# EAGLE design 13A-777 (EAGLE 9.6.2)
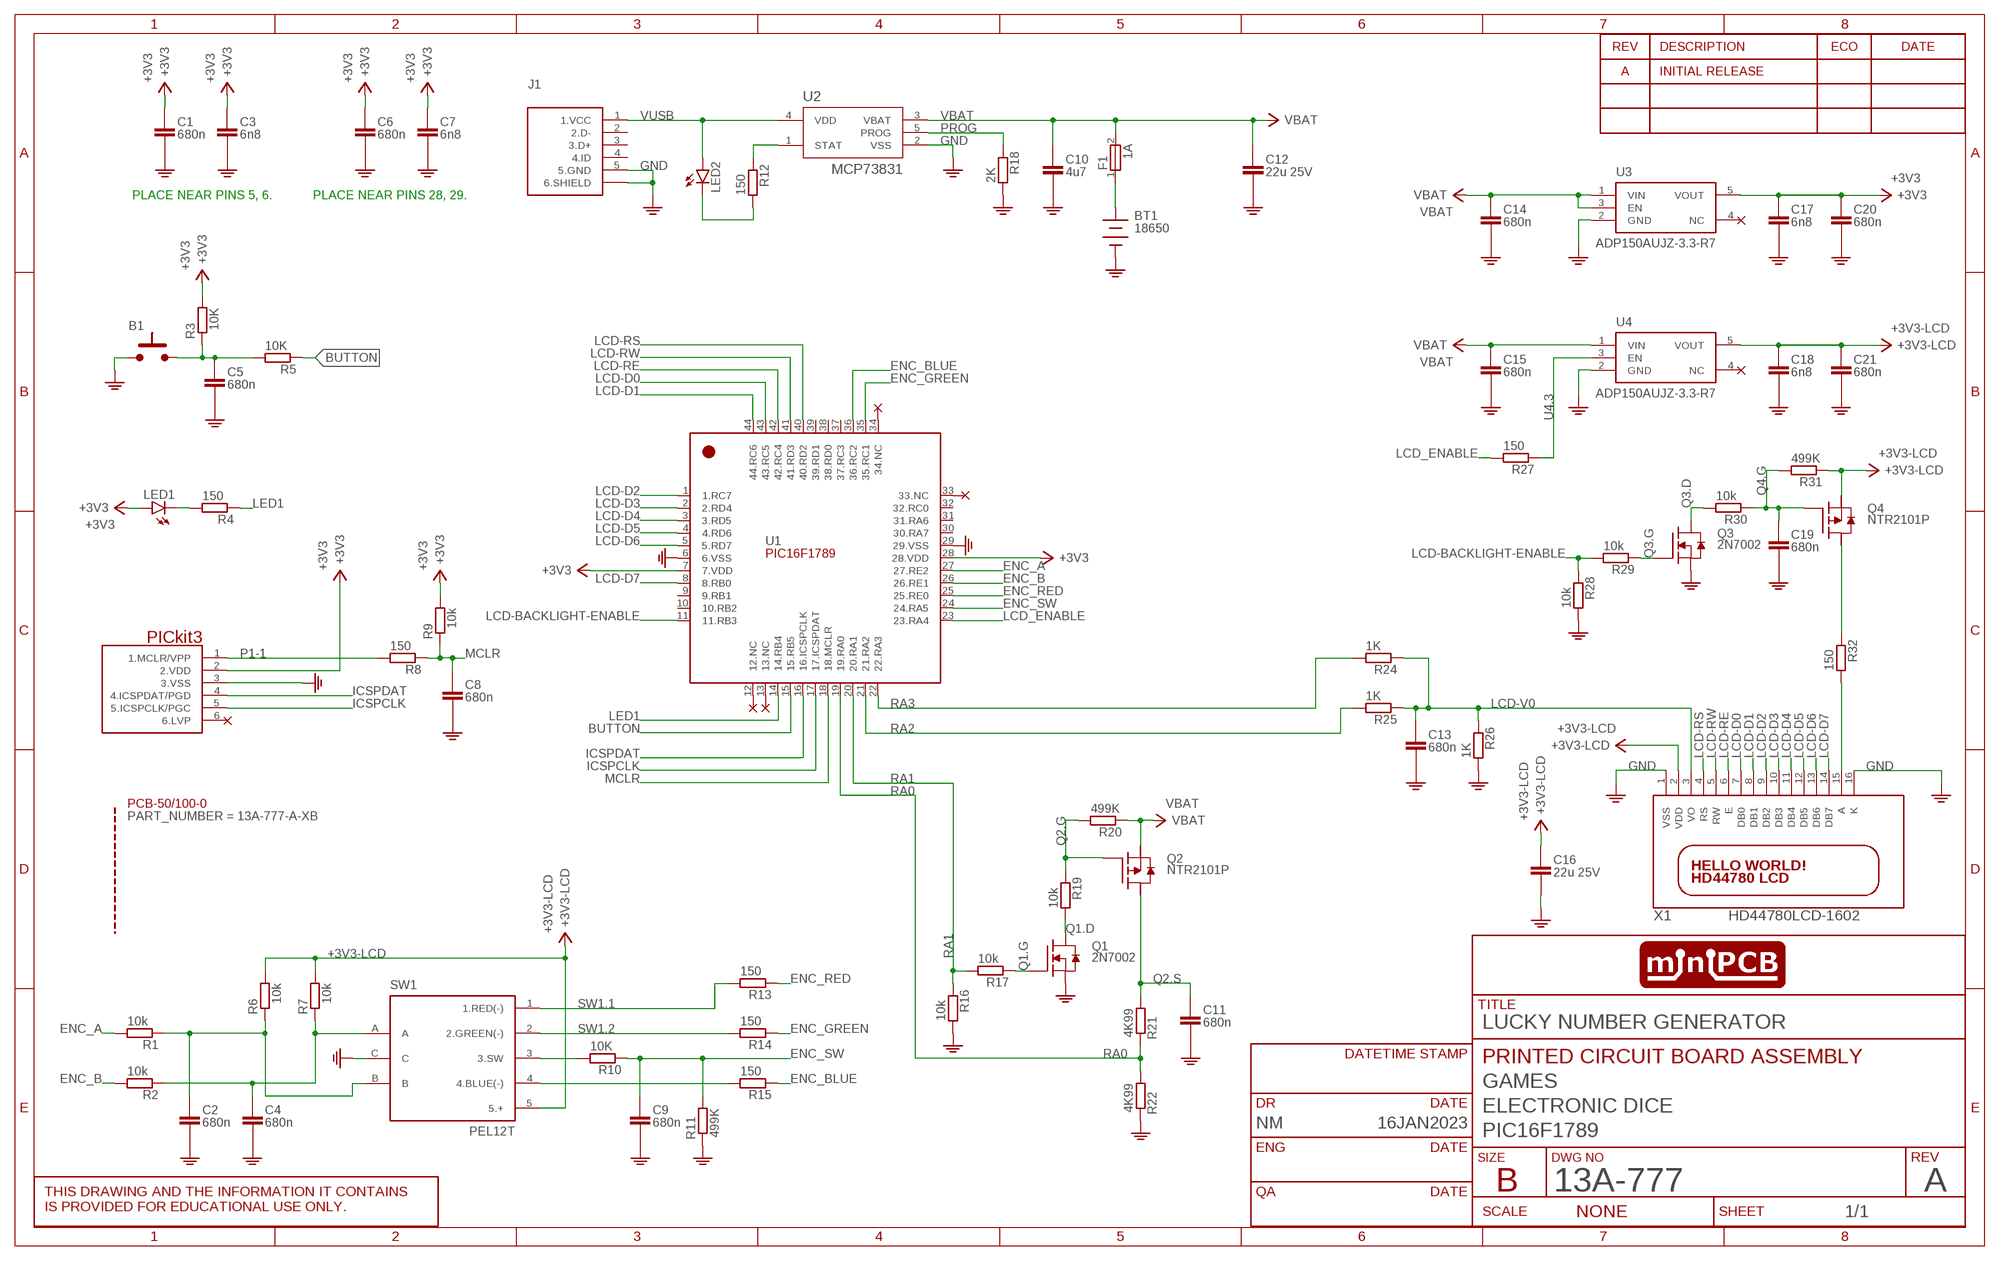
[diagram p0: schematic, sheet 1]
SHEET1 (SCHEMATIC): CIRCUIT_CATEGORY: GAMES; CIRCUIT_NAME: ELECTRONIC DICE; CIRCUIT_VARIANT: PIC16F1789; DR: NM; DR_DATE: 16JAN2023; PCB_PCBA: PRINTED CIRCUIT BOARD ASSEMBLY; REVA: A; REVISION: A; TITLE: LUCKY NUMBER GENERATOR

## Parts
B1  PUSHBUTTON6X6MM  [6X6MM]
BT1  18650  BATTERY18650-NOHOLES  [BATTERY-18650-1-NOHOLES]
C1  680n  CAPACITOR1206  [C1206]
C2  680n  CAPACITOR1206  [C1206]
C3  6n8  CAPACITOR1206  [C1206]
C4  680n  CAPACITOR1206  [C1206]
C5  680n  CAPACITOR1206  [C1206]
C6  680n  CAPACITOR1206  [C1206]
C7  6n8  CAPACITOR1206  [C1206]
C8  680n  CAPACITOR1206  [C1206]
C9  680n  CAPACITOR1206  [C1206]
C10  4u7  CAPACITOR1206  [C1206]
C11  680n  CAPACITOR1206  [C1206]
C12  22u 25V  CAPACITOR3.5MM  [C3-5MM]
C13  680n  CAPACITOR1206  [C1206]
C14  680n  CAPACITOR1206  [C1206]
C15  680n  CAPACITOR1206  [C1206]
C16  22u 25V  CAPACITOR3.5MM  [C3-5MM]
C17  6n8  CAPACITOR1206  [C1206]
C18  6n8  CAPACITOR1206  [C1206]
C19  680n  CAPACITOR1206  [C1206]
C20  680n  CAPACITOR1206  [C1206]
C21  680n  CAPACITOR1206  [C1206]
F1  1A  FUSE-1812-1A  [1812L010DR]
J1  USB2LUG  [USB_MICRO_B]
LED1  LEDCHIP-LED0805  [CHIP-LED0805]
LED2  LEDCHIP-LED0805  [CHIP-LED0805]
PCB  PCB-50/100-0  MINIPCB_0P50X100MM  [MINIPCB_0P_50X100MM]
Q1  2N7002  MOSFET-NSOT23  [SOT23]
Q2  NTR2101P  MOSFET-PNTR2101PT1G  [SOT23]
Q3  2N7002  MOSFET-NSOT23  [SOT23]
Q4  NTR2101P  MOSFET-PNTR2101PT1G  [SOT23]
R1  10k  RESISTORSMD  [R0805]
R2  10k  RESISTORSMD  [R0805]
R3  10K  RESISTORSMD  [R0805]
R4  150  RESISTORSMD  [R0805]
R5  10K  RESISTORSMD  [R0805]
R6  10k  RESISTORSMD  [R0805]
R7  10k  RESISTORSMD  [R0805]
R8  150  RESISTORSMD  [R0805]
R9  10k  RESISTORSMD  [R0805]
R10  10K  RESISTORSMD  [R0805]
R11  499K  RESISTORSMD  [R0805]
R12  150  RESISTORSMD  [R0805]
R13  150  RESISTORSMD  [R0805]
R14  150  RESISTORSMD  [R0805]
R15  150  RESISTORSMD  [R0805]
R16  10k  RESISTORSMD  [R0805]
R17  10k  RESISTORSMD  [R0805]
R18  2K  RESISTORSMD  [R0805]
R19  10k  RESISTORSMD  [R0805]
R20  499K  RESISTORSMD  [R0805]
R21  4K99  RESISTORSMD  [R0805]
R22  4K99  RESISTORSMD  [R0805]
R24  1K  RESISTORSMD  [R0805]
R25  1K  RESISTORSMD  [R0805]
R26  1K  RESISTORSMD  [R0805]
R27  150  RESISTORSMD  [R0805]
R28  10k  RESISTORSMD  [R0805]
R29  10k  RESISTORSMD  [R0805]
R30  10k  RESISTORSMD  [R0805]
R31  499K  RESISTORSMD  [R0805]
R32  150  RESISTORSMD  [R0805]
SW1  PEL12T  SWITCH-ROTARY_ENCODER+SW+3LEDSPEL12T  [SWITCH-ROTARY_ENCODER-12MM]
U1  PIC16F1789T-I/PT  PIC16F1789  [SQFP-S-10X10-44]
U2  MCP73831  MCP73831T-2ATI/OTSOT-23-5_MC_MCH  [SOT-23-5_MC_MCH]
U3  ADP150AUJZ-3.3-R7  ADP150  [SOT25]
U4  ADP150AUJZ-3.3-R7  ADP150  [SOT25]
U$1  PICKIT3ARROW  [PINS_6_PICKIT3]
X1  HD44780LCD-1602  [LCD1602]

## Nets
+3V3: C1.+ C3.+ C6.+ C7.+ C17.+ C20.+ LED1.A R3.2 R9.2 U1.7(7.VDD) U1.28(28.VDD) U3.5(VOUT) U$1.2(2.VDD)
+3V3-LCD: C16.+ C18.+ C21.+ Q4.3(S) R6.2 R7.2 R31.1 SW1.5(5.+) U4.5(VOUT) X1.2(VDD)
B1: B1.3.B B1.4.B C5.+ R3.1 R5.2
BT+: BT1.+ F1.1
BUTTON: R5.1 U1.15(15.RB5)
ENC_A: R1.2 U1.27(27.RE2)
ENC_B: R2.2 U1.26(26.RE1)
ENC_BLUE: R15.1 U1.36(36.RC2)
ENC_GREEN: R14.1 U1.35(35.RC1)
ENC_RED: R13.1 U1.25(25.RE0)
ENC_SW: C9.+ R10.1 R11.2 U1.24(24.RA5)
GND: B1.1.A B1.2.A BT1.1(-) C1.- C2.- C3.- C4.- C5.- C6.- C7.- C8.- C9.- C10.- C11.- C12.- C13.- C14.- C15.- C16.- C17.- C18.- C19.- C20.- C21.- J1.5(5.GND) J1.GND5(6.SHIELD) J1.GND6(6.SHIELD) J1.GND7(6.SHIELD) J1.GND8(6.SHIELD) J1.GND9(6.SHIELD) J1.GND10(6.SHIELD) J1.XPAD3(6.SHIELD) J1.XPAD4(6.SHIELD) Q1.2(S) Q3.2(S) R11.1 R16.2 R18.2 R22.1 R26.2 R28.2 SW1.C U1.6(6.VSS) U1.29(29.VSS) U2.2(VSS) U3.2(GND) U4.2(GND) U$1.3(3.VSS) X1.1(VSS) X1.16(K)
ICSPCLK: U1.17(17.ICSPDAT) U$1.5(5.ICSPCLK/PGC)
ICSPDAT: U1.16(16.ICSPCLK) U$1.4(4.ICSPDAT/PGD)
LCD-BACKLIGHT-A: R32.2 X1.15(A)
LCD-BACKLIGHT-ENABLE: R28.1 R29.2 U1.11(11.RB3)
LCD-D0: U1.43(43.RC5) X1.7(DB0)
LCD-D1: U1.44(44.RC6) X1.8(DB1)
LCD-D2: U1.1(1.RC7) X1.9(DB2)
LCD-D3: U1.2(2.RD4) X1.10(DB3)
LCD-D4: U1.3(3.RD5) X1.11(DB4)
LCD-D5: U1.4(4.RD6) X1.12(DB5)
LCD-D6: U1.5(5.RD7) X1.13(DB6)
LCD-D7: U1.8(8.RB0) X1.14(DB7)
LCD-RE: U1.42(42.RC4) X1.6(E)
LCD-RS: U1.40(40.RD2) X1.4(RS)
LCD-RW: U1.41(41.RD3) X1.5(RW)
LCD-V0: C13.+ R24.1 R25.1 R26.1 X1.3(VO)
LCD_ENABLE: R27.2 U1.23(23.RA4)
LED1: R4.1 U1.14(14.RB4)
LED1.K: LED1.C R4.2
LED2.K: LED2.C R12.2
MCLR: C8.+ R8.1 R9.1 U1.18(18.MCLR)
P1-1: R8.2 U$1.1(1.MCLR/VPP)
PROG: R18.1 U2.5(PROG)
Q1.D: Q1.3(D) R19.2
Q1.G: Q1.1(G) R17.1
Q2.G: Q2.1(G) R19.1 R20.2
Q2.S: C11.+ Q2.2(D) R21.2
Q3.D: Q3.3(D) R30.2
Q3.G: Q3.1(G) R29.1
Q4.G: C19.+ Q4.1(G) R30.1 R31.2
Q4.S: Q4.2(D) R32.1
RA0: R21.1 R22.2 U1.19(19.RA0)
RA1: R16.1 R17.2 U1.20(20.RA1)
RA2: R25.2 U1.21(21.RA2)
RA3: R24.2 U1.22(22.RA3)
SW1.1: R13.2 SW1.1(1.RED(-))
SW1.2: R14.2 SW1.2(2.GREEN(-))
SW1.3: R10.2 SW1.3(3.SW)
SW1.4: R15.2 SW1.4(4.BLUE(-))
SW1.A: C2.+ R1.1 R6.1 SW1.B
SW1.B: C4.+ R2.1 R7.1 SW1.A
U4.1: R12.1 U2.1(STAT)
U4.3: R27.1 U4.3(EN)
VBAT: C10.+ C12.+ C14.+ C15.+ F1.2 Q2.3(S) R20.1 U2.3(VBAT) U3.1(VIN) U3.3(EN) U4.1(VIN)
VUSB: J1.1(1.VCC) LED2.A U2.4(VDD)
Unconnected: J1.2(2.D-) J1.3(3.D+) J1.4(4.ID) U1.9(9.RB1) U1.10(10.RB2) U1.12(12.NC) U1.13(13.NC) U1.30(30.RA7) U1.31(31.RA6) U1.32(32.RC0) U1.33(33.NC) U1.34(34.NC) U1.37(37.RC3) U1.38(38.RD0) U1.39(39.RD1) U3.4(NC) U4.4(NC) U$1.6(6.LVP)

## Notes on the sheet
- PLACE NEAR PINS 5, 6. | PLACE NEAR PINS 28, 29.

## Library data of the parts
B1 = minipcb:PUSHBUTTON: Tactile push button switch
BT1 = minipcb:BATTERY: 2xAAA battery holder for VIVA
C1-C21 = minipcb:CAPACITOR
F1 = minipcb:FUSE-1812-1A: Resettable Fuses - PPTC PTC 60V POLYFUSE SURF MOUNT 1812 0.5A Source: Datasheet <http://www.littelfuse.com/~/media/electronics/datasheets/resettable_ptcs/littelfuse_ptc_1812l_datasheet.pdf.pdf>; ARROW_PART_NUMBER: 1812L050/60MR; ARROW_PRICE-STOCK: https://www.arrow.com/en/products/1812l05060mr/littelfuse?region=nac; DESCRIPTION: Resettable Fuses - PPTC PTC 60V POLYFUSE SURF MOUNT 1812 0.5A; HEIGHT: 1.25mm; MANUFACTURER_NAME: LITTELFUSE; MANUFACTURER_PART_NUMBER: 1812L050/60MR; MOUSER_PART_NUMBER: 576-1812L050/60MR; MOUSER_PRICE-STOCK: https://www.mouser.co.uk/ProductDetail/Littelfuse/1812L050-60MR?qs=lM4gFlnEeEOTL6GzziLnSw%3D%3D
J1 = minipcb:USB
LED1 LED2 = minipcb:LED: LED OSRAM: - CHIPLED LG R971, LG N971, LY N971, LG Q971, LY Q971, LO R971, LY R971 LH N974, LH R974 LS Q976, LO Q976, LY Q976 LO Q996 - Hyper CHIPLED LW Q18S LB Q993, LB Q99A, LB R99A - SideLED LS A670, LO A670, LY A670, LG A670, LP A670 LB A673, LV A673, LT A673, LW A673 LH A674 LY A675 LS A676, LA A676, LO A676, LY A676, LW A676 LS A679, LY A679, LG A679 - Hyper Micro SIDELED® LS Y876, LA Y876, LO Y876, LY Y876 LT Y87S - SmartLED LW L88C, LW L88S LB L89C, LB L89S, LG L890 LS L89K, LO L89K, LY L89K LS L896, LA L896, LO L896, LY L896 - TOPLED LS T670, LO T670, LY T670, LG T670, LP T670 LSG T670, LSP T670, LSY T670, LOP T670, LYG T670 LG T671, LOG T671, LSG T671 LB T673, LV T673, LT T673, LW T673 LH T674 LS T676, LA T676, LO T676, LY T676, LB T676, LH T676, LSB T676, LW T676 LB T67C, LV T67C, LT T67C, LS T67K, LO T67K, LY T67K, LW E67C LS E67B, LA E67B, LO E67B, LY E67B, LB E67C, LV E67C, LT E67C LW T67C LS T679, LY T679, LG T679 LS T770, LO T770, LY T770, LG T770, LP T770 LB T773, LV T773, LT T773, LW T773 LH T774 LS E675, LA E675, LY E675, LS T675 LS T776, LA T776, LO T776, LY T776, LB T776 LHGB T686 LT T68C, LB T68C - Hyper Mini TOPLED® LB M676 - Mini TOPLED Santana® LG M470 LS M47K, LO M47K, LY M47K Source: http://www.osram.convergy.de LUXEON: - LUMILED® LXK2-PW12-R00, LXK2-PW12-S00, LXK2-PW14-U00, LXK2-PW14-V00 LXK2-PM12-R00, LXK2-PM12-S00, LXK2-PM14-U00 LXK2-PE12-Q00, LXK2-PE12-R00, LXK2-PE12-S00, LXK2-PE14-T00, LXK2-PE14-U00 LXK2-PB12-K00, LXK2-PB12-L00, LXK2-PB12-M00, LXK2-PB14-N00, LXK2-PB14-P00, LXK2-PB14-Q00 LXK2-PR12-L00, LXK2-PR12-M00, LXK2-PR14-Q00, LXK2-PR14-R00 LXK2-PD12-Q00, LXK2-PD12-R00, LXK2-PD12-S00 LXK2-PH12-R00, LXK2-PH12-S00 LXK2-PL12-P00, LXK2-PL12-Q00, LXK2-PL12-R00 Source: www.luxeon.com KINGBRIGHT: KA-3528ASYC Source: www.kingbright.com
PCB = minipcb:MINIPCB_0P; PART_NUMBER: 13A-777-A-XB; REVISION: A
Q1 Q3 = minipcb:MOSFET-N
Q2 Q4 = minipcb:MOSFET-P
R1-R22 R24-R32 = minipcb:RESISTOR
SW1 = minipcb:SWITCH-ROTARY_ENCODER+SW+3LEDS: PEL12T - 12 mm Encoder with Switch and Illuminated Shaft PEL12T-4xxxF-S1024
U1 = minipcb:PIC16F1789
U2 = minipcb:MCP73831T-2ATI/OT; COPYRIGHT: Copyright (C) 2023 Ultra Librarian. All rights reserved.; MANUFACTURER_PART_NUMBER: MCP73831T-2ATI/OT; MFR_NAME: Microchip
U3 U4 = minipcb:ADP150: Ultralow Noise, 150mA CMOS Linear Regulator
U$1 = minipcb:PICKIT3
X1 = minipcb:HD44780LCD: HD44780 LCD Standard character type LCDs, available in sizes from 8x1 to 40x4!

## Board
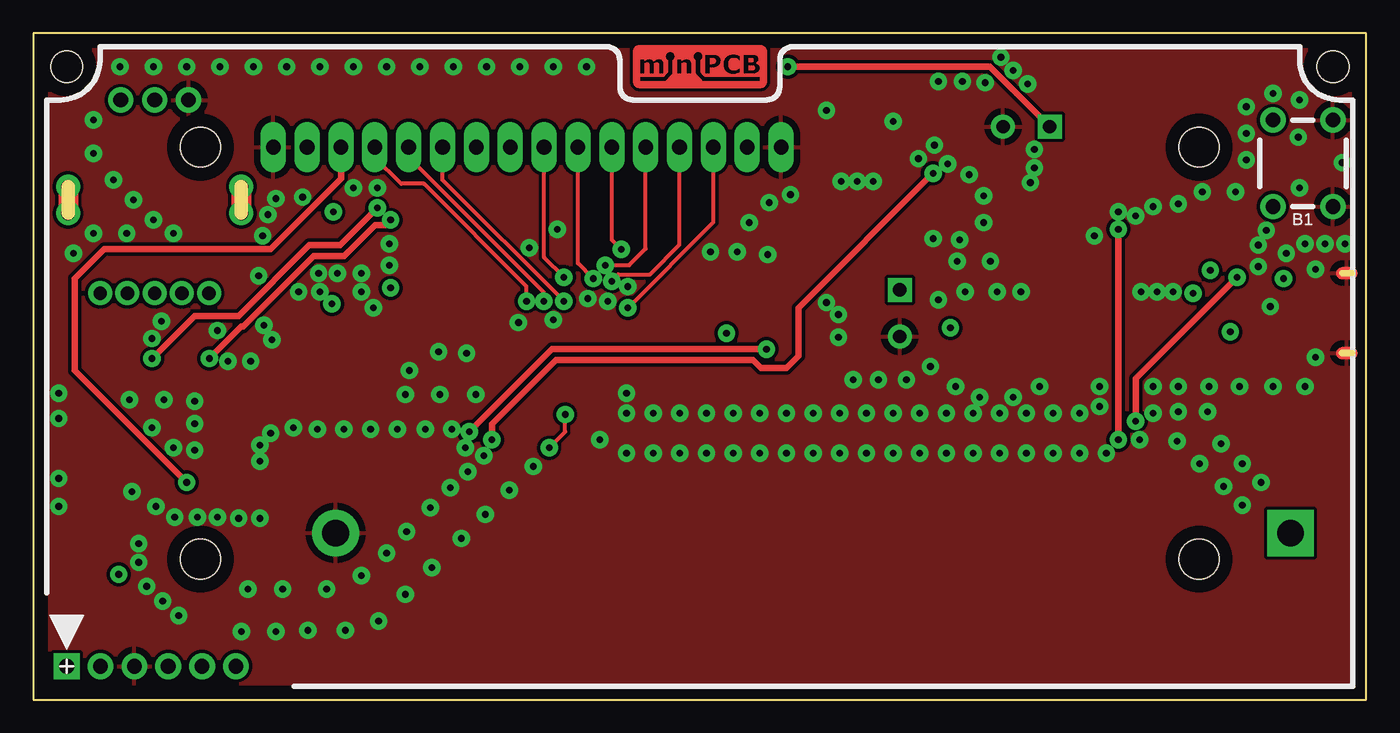
[diagram p1: board, top side]
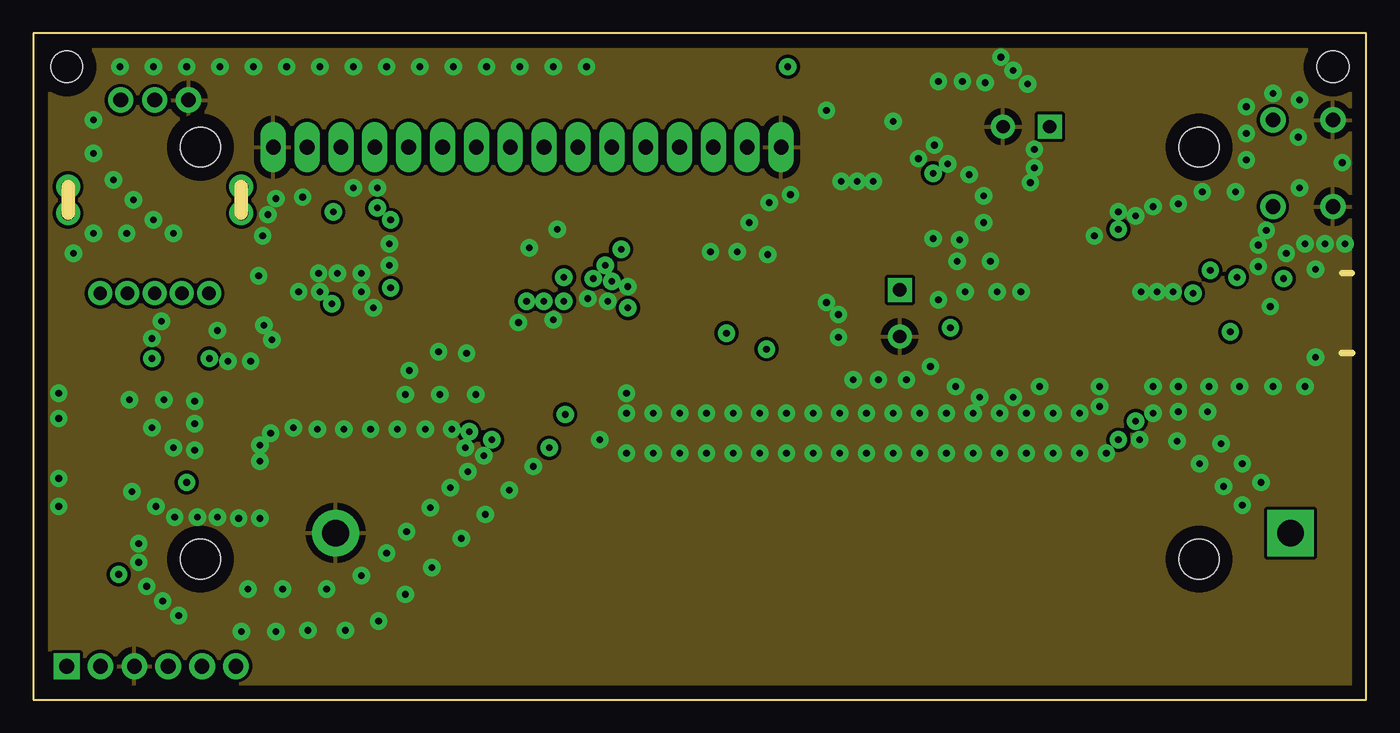
[diagram p2: board, inner layer Route2]
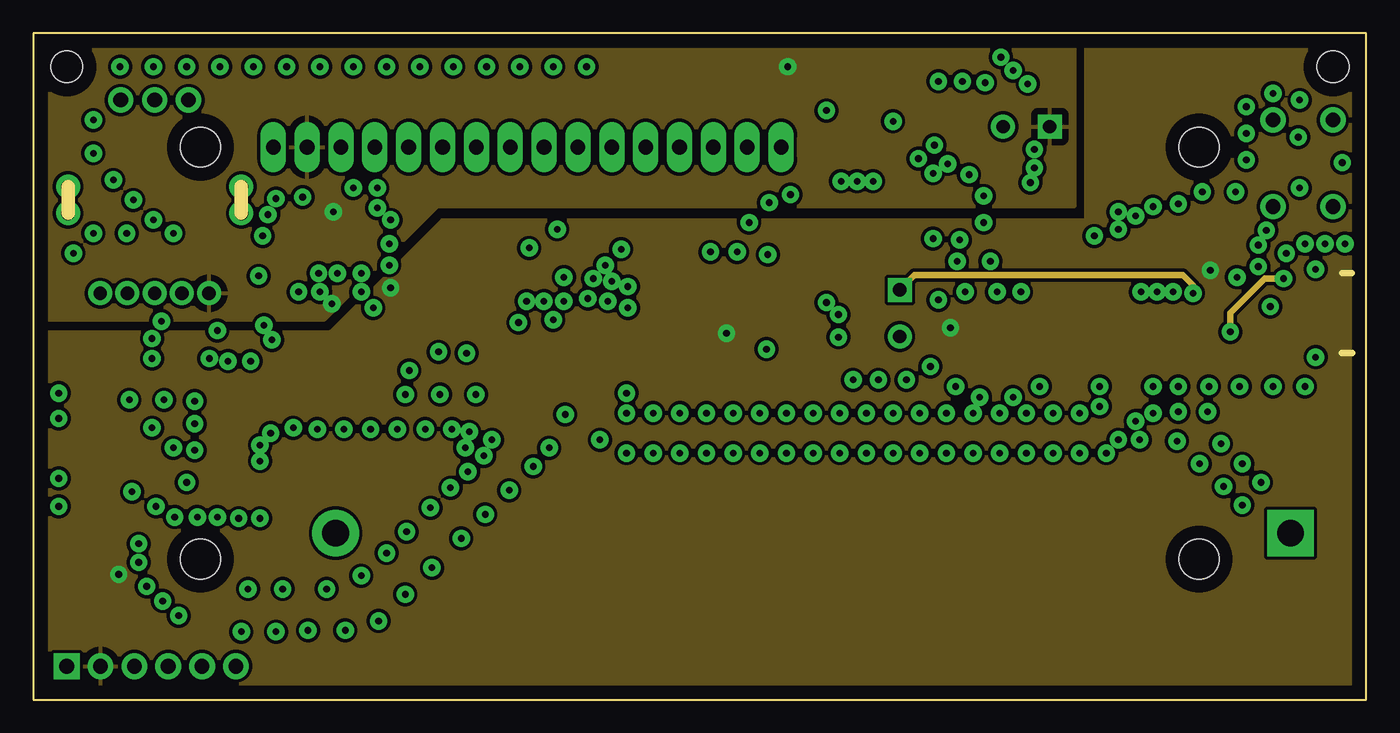
[diagram p3: board, inner layer Route15]
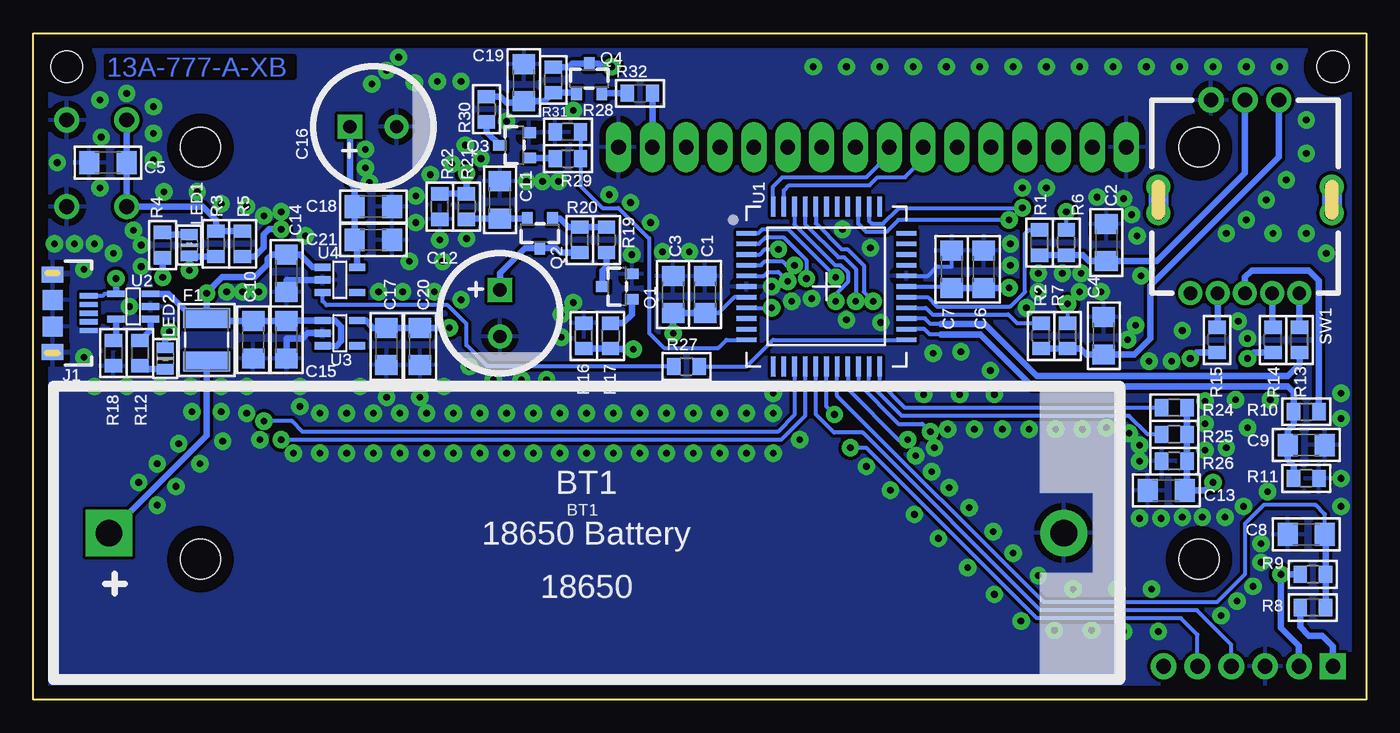
[diagram p4: board, bottom side, seen from below]

Size 100 x 50 mm. Coordinates in mm from the lower left corner, seen from the top.
Outline: 0,0 100,0 100,50 0,50 0,0
Copper layers (1*16): Top 0.035mm / dielectric 1.5mm / Bottom 0.035mm
Design rules "minipcb": minimum track width 0.2mm, minimum drill 0.5mm, track to track 0.25mm, track to pad 0.5mm, pad to pad 0.5mm, via to via 0.5mm, smd to smd 0.15mm, copper to edge 1mm, drill to drill 1mm, minimum pad ring 0.4mm, minimum via ring 0.4mm, stop-mask expansion 0.1mm, vias tented up to drill 0.6mm, thermal gap 0.5mm

### Footprints (pad centres in the part's own frame; a part is rotated, then mirrored left to right if it is on the bottom)
6X6MM = drill 1.1: 1.A 0,0; 2.A 6.5,0; 3.B 0,4.5; 4.B 6.5,4.5
BATTERY-18650-1-NOHOLES = drill 2 pad 3.5: 1 35.82,0 | drill 2 pad 3.5 square: + -35.82,0
C1206 = smd 1.5 x 1.7: + -1.4,0; - 1.4,0
C3-5MM = drill 1 square: + -1.75,0 | drill 1: - 1.75,0
1812L010DR = smd 1.5 x 3.5: 1 -1.615,0; 2 1.615,0
USB_MICRO_B = smd 0.4 x 1.35: 1 -1.3,1.35; 2 -0.65,1.35; 3 0,1.35; 4 0.65,1.35; 5 1.3,1.35 | smd 0.9 x 1.6: GND5 -3,-1.35; GND8 3,-1.35 | smd 0.9 x 1.6 bottom: GND6 -3,-1.35; GND9 3,-1.35 | smd 1.2 x 1.6: GND7 -2.9,-1.35; GND10 2.9,-1.35 | smd 1.5 x 1.5: XPAD3 -1,-1.35; XPAD4 1,-1.35
CHIP-LED0805 = smd 1.27 x 0.8: A 0,-0.8; C 0,0.8
MINIPCB_0P_50X100MM = hole 2.4: 97.5,47.5; 2.5,47.5
SOT23 = smd 0.8 x 1: 1 -0.95,-1.1; 2 0.95,-1.1; 3 0,1.1
R0805 = smd 1 x 1.3: 1 -0.95,0; 2 0.95,0
SWITCH-ROTARY_ENCODER-12MM = drill 1: 1 7,4.08; 2 7,2.04; 3 7,0; 4 7,-2.04; 5 7,-4.08; GND1 -1,6.5; GND2 1,6.5; GND3 -1,-6.5; GND4 1,-6.5 | drill 1.1: A -7.5,2.54; B -7.5,0; C -7.5,-2.54
SQFP-S-10X10-44 = smd 0.35 x 1.5: 1 -4,-6; 2 -3.2,-6; 3 -2.4,-6; 4 -1.6,-6; 5 -0.8,-6; 6 0,-6; 7 0.8,-6; 8 1.6,-6; 9 2.4,-6; 10 3.2,-6; 11 4,-6; 23 4,6; 24 3.2,6; 25 2.4,6; 26 1.6,6; 27 0.8,6; 28 0,6; 29 -0.8,6; 30 -1.6,6; 31 -2.4,6; 32 -3.2,6; 33 -4,6 | smd 1.5 x 0.35: 12 6,-4; 13 6,-3.2; 14 6,-2.4; 15 6,-1.6; 16 6,-0.8; 17 6,0; 18 6,0.8; 19 6,1.6; 20 6,2.4; 21 6,3.2; 22 6,4; 34 -6,4; 35 -6,3.2; 36 -6,2.4; 37 -6,1.6; 38 -6,0.8; 39 -6,0; 40 -6,-0.8; 41 -6,-1.6; 42 -6,-2.4; 43 -6,-3.2; 44 -6,-4
SOT-23-5_MC_MCH = smd 1.321 x 0.508: 1 -1.295,0.95; 2 -1.295,0; 3 -1.295,-0.95; 4 1.295,-0.95; 5 1.295,0.95
SOT25 = smd 0.55 x 1.2: 1 -0.95,-1.3; 2 0,-1.3; 3 0.95,-1.3; 4 0.95,1.3; 5 -0.95,1.3
PINS_6_PICKIT3 = drill 1.1 pad 1.93 square: 1 0,0 | drill 1.1 pad 1.93: 2 0,-2.54; 3 0,-5.08; 4 0,-7.62; 5 0,-10.16; 6 0,-12.7
LCD1602 = drill 1.1 long: 1 8,33.46; 2 10.54,33.46; 3 13.08,33.46; 4 15.62,33.46; 5 18.16,33.46; 6 20.7,33.46; 7 23.24,33.46; 8 25.78,33.46; 9 28.32,33.46; 10 30.86,33.46; 11 33.4,33.46; 12 35.94,33.46; 13 38.48,33.46; 14 41.02,33.46; 15 43.56,33.46; 16 46.1,33.46 | hole 3: 2.54,2.54; 2.54,33.46; 77.46,33.46; 77.46,2.54

### Placement (x,y rotation side)
B1  97.5,37 90 top
BT1  58.5,12.5 0 bottom
C1  49.6,30.4 90 bottom
C2  19.5,34.3 90 bottom
C3  52,30.4 90 bottom
C4  19.7,27.3 90 bottom
C5  94.4,40.3 180 bottom
C6  28.7,32.3 90 bottom
C7  31.1,32.3 90 bottom
C8  4.5,12.4 180 bottom
C9  4.5,19.1 0 bottom
C10  83.5,27 270 bottom
C11  65,37.5 90 bottom
C12  65,29 270 bottom
C13  15,15.7 180 bottom
C14  81,32 270 bottom
C15  81,27 270 bottom
C16  74.5,43 0 bottom
C17  73.5,26.5 270 bottom
C18  74.5,37 0 bottom
C19  63.2,46.3 90 bottom
C20  71,26.5 270 bottom
C21  74.5,34.5 0 bottom
F1  87,27 90 bottom
J1  97.2,29 270 bottom
LED1  88.3,34.1 0 bottom
LED2  90.1,25.6 180 bottom
PCB  0,0 0 top
Q1  56.2,31 90 bottom
Q2  62,35 180 bottom
Q3  63.9,41.6 90 bottom
Q4  58.3,46.6 0 bottom
R1  24.5,34.3 90 bottom
R2  24.4,27.3 90 bottom
R3  86.3,34.2 270 bottom
R4  90.3,34.1 90 bottom
R5  84.3,34.2 90 bottom
R6  22.5,34.3 90 bottom
R7  22.4,27.3 90 bottom
R8  4,6.9 180 bottom
R9  4,9.4 180 bottom
R10  4.5,21.6 0 bottom
R11  4.5,16.6 180 bottom
R12  92,26 270 bottom
R13  5,27 90 bottom
R14  7,27 90 bottom
R15  11.2,27 90 bottom
R16  58.7,27.3 90 bottom
R17  56.7,27.3 270 bottom
R18  94,26 270 bottom
R19  57,34.5 270 bottom
R20  59,34.5 90 bottom
R21  67.5,37 270 bottom
R22  69.5,37 90 bottom
R24  14.4,21.9 180 bottom
R25  14.4,19.9 180 bottom
R26  14.4,17.9 180 bottom
R27  51,25 0 bottom
R28  59.9,42.6 180 bottom
R29  59.9,40.6 0 bottom
R30  66,44.3 270 bottom
R31  61,46.5 270 bottom
R32  54.5,45.5 0 bottom
SW1  9.1,37.5 270 bottom
U1  40.5,31 270 bottom
U2  92.5,29.5 180 bottom
U3  77,27.5 270 bottom
U4  77,31.5 270 bottom
U$1  2.5,2.5 90 top
X1  10,8 0 top

### Tracks (layer width: path | path; a pad name or v marks a point on that pad's centre or on a via)
+3V3  (via drill 0.5)
  Bottom 0.3: U1.28 31.2,31 C7.+ 30.1,30.9 | U1.7 47.4,30.2 48.6,29 C1.+
  Bottom 0.5: U3.5 75.05,28.45 74.5,27.9 C17.+ C20.+ v68.8,27.9 | U$1.2 5.04,4.04 6.4,5.4 v6.4,9.4 R9.2 | C7.+ C6.+ v26.8,30.9 | C1.+ C3.+ v52,27.5 | R3.2 88.25,33.25 | 88.25,33.25 LED1.A | v88.3,32.2 88.3,33.2 88.25,33.25
  pour Route15: 99,1 1,1 1,27.6 22.3,27.6 30.7,36 79,36 79,49 99,49
+3V3-LCD  (via drill 0.5)
  Top 0.5: C16.+ 71.75,47.5 v56.6,47.5
  Bottom 0.3: R6.2 v22.5,36.6 | R7.2 v22.4,29.7
  Bottom 0.5: U4.5 75.7,34.3 C21.+ C18.+ 75.9,38.4 76.25,38.75 C16.+ | v56.6,47.5 57.4,47.5 57.6,47.7 Q4.3 59.6,47.7 59.85,47.45 R31.1
  pour Route15: 78.1,49 78.1,37 30.3,37 21.8,28.5 1,28.5 1,49
B1
  Bottom 0.5: B1.4.B C5.+ B1.3.B 87.3,37 86.3,36 R3.1 R5.2
BT+
  Bottom 0.5: BT1.+ 87,19.82 F1.1
BUTTON  (via drill 0.5)
  Top 0.5: v81.4,19.5 v81.4,35.3
  Bottom 0.3: U1.15 42.1,21.3 43.9,19.5 v81.4,19.5
  Bottom 0.5: R5.1 83.38,33.25 82.72,33.92 82.72,34.88 82.4,35.2 82.3,35.3 v81.4,35.3
ENC_A
  Bottom 0.3: U1.27 32.9,30.2 32.2,29.5 26.7,29.5 25.6,30.6 25.6,34.95 25.3,35.25 R1.2
ENC_B
  Bottom 0.3: U1.26 33.05,29.4 32.55,28.9 26.85,28.9 26.2,28.25 R2.2
ENC_BLUE  (via drill 0.5)
  Top 0.5: v13.2,25.6 15.6,28 15.73,28 21.03,33.3 23.33,33.3 25.63,35.6 26.4,35.6 v26.8,36
  Bottom 0.3: v26.8,36 35.1,36 36,35.1 37.5,35.1 38.1,35.7 U1.36
  Bottom 0.5: R15.1 12.75,26.05 v13.2,25.6
ENC_GREEN  (via drill 0.5)
  Top 0.5: v8.9,25.6 12.1,28.8 15.4,28.8 20.7,34.1 23,34.1 v25.8,36.9
  Bottom 0.3: U1.35 37.3,35.9 37.1,35.7 36.25,35.7 35.05,36.9 v25.8,36.9
  Bottom 0.5: R14.1 8.45,26.05 v8.9,25.6
ENC_RED
  Bottom 0.3: U1.25 33.1,28.6 32.7,28.2 31.9,28.2
  Bottom 0.5: R13.1 5,25.2 5.9,24.3 24.7,24.3 28.6,28.2 31.9,28.2
ENC_SW
  Bottom 0.3: U1.24 33.15,27.8 32.75,27.4 31.9,27.4
  Bottom 0.5: R11.2 5.45,17.55 5.9,18 C9.+ 5.9,20.2 5.45,20.65 R10.1 5.45,23.05 5.9,23.5 25.03,23.5 28.93,27.4 31.9,27.4
GND  (via drill 0.5)
  Bottom 0.3: U1.29 32.9,31.8 32.2,32.5 31.1,32.5 C7.-
  Bottom 0.5: U3.2 79.4,27.5 79.8,27.1 81,27.1 C15.- | U4.2 81,31.5 C14.-
  other vias: 92.8,29.5 85.5,30.6 84.3,30.6 83.1,30.6 44.6,31 50.8,33.6 71.3,35.8 71.3,37.8 69.5,34.5 55.1,33.4 52.8,33.6 63,38.9 66.4,40.6 61.8,38.9 60.6,38.9 56.8,37.9 55.2,37.3 53.7,35.8 67.6,41.6 64.5,43.4 59.5,44.2 60.4,27.2 60.4,28.9 59.5,29.8 17,17.9 17,19.1 17,13.6 15.4,13.6 13.8,13.7 12.3,13.7 10.6,13.7 7.9,11.7 7.9,10.3 8.5,8.5 10.9,6.3 9.7,7.4 9.2,14.5 7.4,15.6 12.1,22.4 9.8,22.5 7.2,22.5 12.1,18.7 12.1,20.7 17.8,20 19.5,20.4 31.4,20.3 33.8,18.3 29.4,20.3 27.3,20.3 32.6,17.1 32.4,18.9 31.3,15.9 29.8,14.4 95.4,23.5 93,23.5 90.5,23.5 88.2,23.5 85.9,23.5 84,23.5 80,23.5 75.5,23.5 69.2,23.5 73.5,22.7 71,22.7 74.1,30.6 72.3,30.6 69.9,30.6 67.9,30 69.3,32.9 71.8,32.9 67.5,34.6 95,38.4 94.9,42.2 98.2,40.3 90.2,38.1 87.7,38.1 85.9,37.2 91.9,34.1 92.5,35.2 91.9,32.5 82.7,36.3 81.4,36.6 79.6,34.8 75.1,41.3 75.1,39.9 74.8,38.8 70.2,39.4 68.6,40.2 71.4,46.3 69.7,46.4 67.9,46.4 74.6,46.2 73.5,47.2 72.6,48.2 17.9,27 17.3,28.1 21.4,32 19.9,30.6 16.9,31.8 22.8,32 24.6,32 25.5,29.4 24.6,30.6 21.5,30.6 20.2,37.7 18.2,37.6 17.6,36.4 17.2,34.8 25.8,38.4 24,38.4 26.7,34.2 26.7,32.6 37.2,33.9 39.3,35.3 36.4,28.3 39,28.5 43.1,29.9 41.6,30.1 32.5,26 30.4,26.1 28.2,24.7 33.2,22.9 30.5,22.9 27.9,22.9 16.3,25.4 14.6,25.4 13.8,27.7 8.9,27.1 9.6,28.4 10.5,18.9 8.9,20.4 1.9,21.1 1.9,23 1.9,16.6 1.9,14.5 65.5,24 63.4,24 61.5,24 67.3,25 37.5,17.5 35.7,15.7 33.9,13.9 32.1,12.1 29.9,9.9 27.9,7.9 25.9,5.9 23.4,5.2 20.6,5.2 18.2,5.1 15.6,5.1 28,12.6 26.5,11 24.6,9.3 22,8.3 18.7,8.3 16.1,8.3 98.4,34.2 96.9,34.2 95.4,34.2 96.2,25.7 96.2,32.3 88.1,21.6 89.1,19.2 92.1,16.3 90.7,17.7 85.9,21.6 87.5,17.7 89.3,16 90.7,14.6 85.8,19.4 74.5,18.5 78.5,21.5 72.5,18.5 70.5,18.5 68.5,18.5 66.5,18.5 64.5,18.5 62.5,18.5 60.5,18.5 58.5,18.5 56.5,18.5 54.5,18.5 52.5,18.5 50.5,18.5 48.5,18.5 76.5,21.5 74.5,21.5 72.5,21.5 70.5,21.5 68.5,21.5 66.5,21.5 64.5,21.5 62.5,21.5 60.5,21.5 58.5,21.5 56.5,21.5 54.5,21.5 52.5,21.5 50.5,21.5 80,22 76.5,18.5 78.5,18.5 80.5,18.5 48.5,21.5 46.5,21.5 46.5,18.5 44.5,21.5 44.5,18.5 42.5,19.5 83,19.5 84,21.5 84,37 91,44.5 91,42.5 95,45 93,45.5 91,40.5 94,33.5 44.5,23 25.3,20.3 23.3,20.3 21.3,20.3 16.5,47.5 14,47.5 11.5,47.5 9,47.5 4.5,43.5 4.5,41 6,39 7.5,37.5 19,47.5 21.5,47.5 24,47.5 26.5,47.5 29,47.5 31.5,47.5 34,47.5 36.5,47.5 39,47.5 41.5,47.5 6.5,47.5 9,36 7,35 4.5,35 3,33.5 10.5,35
  pour Bottom: 99,1 1,1 1,49 99,49
  pour Top: 99,1 1,1 1,49 99,49
  pour Route2: 99,1 1,1 1,49 99,49
ICSPCLK  (via drill 0.5)
  Top 0.3: v38.7,18.9 39.9,20.1 v39.9,21.4
  Bottom 0.3: U$1.5 12.66,4.86 13.9,6.1 24.7,6.1 37.5,18.9 v38.7,18.9 | v39.9,21.4 40.5,22 U1.17
ICSPDAT
  Bottom 0.3: U$1.4 10.12,4.12 12.7,6.7 24.45,6.7 37.77,20.03 39.93,20.03 41.3,21.4 U1.16
LCD-BACKLIGHT-A
  Bottom 0.5: R32.2 X1.15
LCD-BACKLIGHT-ENABLE
  Bottom 0.3: U1.11 48,27 48.6,26.4 52.7,26.4 53.8,27.5 53.8,34.6 56.1,36.9 57.3,36.9 58.95,38.55 R29.2 R28.1
LCD-D0
  Bottom 0.3: U1.43 43.7,38.2 43.3,38.6 37.25,38.6 36.65,39.2 34.6,39.2 33.24,40.56 X1.7
LCD-D1
  Bottom 0.3: U1.44 44.5,38.5 43.8,39.2 37.5,39.2 35.78,40.92 X1.8
LCD-D2  (via drill 0.5)
  Top 0.3: v39.8,31.7 38.32,33.18 X1.9
  Bottom 0.3: U1.1 45.6,35 45.3,35.3 43.4,35.3 v39.8,31.7
LCD-D3  (via drill 0.5)
  Top 0.3: v42,31.6 40.86,32.74 X1.10
  Bottom 0.3: U1.2 45.55,34.2 45.05,34.7 43.73,34.7 42,32.97 v42,31.6
LCD-D4  (via drill 0.5)
  Top 0.3: v44.1,33.8 43.4,34.5 X1.11
  Bottom 0.3: U1.3 45.5,33.4 45.1,33.8 v44.1,33.8
LCD-D5  (via drill 0.5)
  Top 0.3: v42.9,32.6 44.7,32.6 45.94,33.84 X1.12
  Bottom 0.3: U1.4 45.4,32.6 45.1,32.9 43.8,32.9 43.5,32.6 v42.9,32.6
LCD-D6  (via drill 0.5)
  Top 0.3: v43.4,31.4 43.9,31.9 46.25,31.9 48.48,34.13 X1.13
  Bottom 0.3: U1.5 45.2,31.8 44.9,32.1 44.1,32.1 v43.4,31.4
LCD-D7  (via drill 0.5)
  Top 0.3: v44.6,29.4 51.02,35.82 X1.14
  Bottom 0.3: U1.8 v44.6,29.4
LCD-RE  (via drill 0.5)
  Top 0.3: v39.8,29.9 30.7,39 X1.6
  Bottom 0.3: U1.42 42.9,35.65 39.85,32.6 39.43,32.6 38.9,32.07 38.9,31.33 39.8,30.43 v39.8,29.9
LCD-RS  (via drill 0.5)
  Top 0.3: v37,29.9 37,31 29.3,38.7 27.6,38.7 25.62,40.68 X1.4
  Bottom 0.3: U1.40 41.3,35.75 39.35,33.8 38.93,33.8 37.7,32.57 37.7,30.6 v37,29.9
LCD-RW  (via drill 0.5)
  Top 0.3: v38.3,29.9 38.3,30.55 28.16,40.69 X1.5
  Bottom 0.3: U1.41 42.1,35.7 39.6,33.2 39.18,33.2 38.3,32.32 v38.3,29.9
LCD-V0  (via drill 0.5)
  Top 0.5: v11.5,16.3 3.1,24.7 3.1,31.6 5.3,33.8 17.8,33.8 23.08,39.08 X1.3
  Bottom 0.5: R24.1 R25.1 R26.1 13.45,15.85 C13.+ 12.1,15.7 v11.5,16.3
LCD_ENABLE
  Bottom 0.3: R27.2 46.5,25 44.5,27 U1.23
LED1  (via drill 0.5)
  Top 0.5: v82.7,20.9 82.7,24.09 90.3,31.69 v90.3,31.7
  Bottom 0.3: U1.14 42.9,21.35 44.15,20.1 79.8,20.1 80.6,20.9 v82.7,20.9
  Bottom 0.5: R4.1 v90.3,31.7
LED1.K
  Bottom 0.5: LED1.C 90.15,34.9 R4.2
LED2.K
  Bottom 0.5: LED2.C 91.75,24.8 R12.2
MCLR
  Bottom 0.3: C8.+ 3.1,13.9 3.8,14.6 7.7,14.6 9.1,13.2 9.1,9.4 11.2,7.3 24.2,7.3 39.7,22.8 U1.18
  Bottom 0.5: R8.1 R9.1 3.05,12.35 C8.+
P1-1
  Bottom 0.5: U$1.1 2.5,4 3.3,4.8 4.3,4.8 4.95,5.45 R8.2
PROG
  Bottom 0.5: R18.1 93.8,27.16 U2.5
Q1.D
  Bottom 0.5: R19.2 57,32.5 57.3,32.2 Q1.3
Q1.G
  Bottom 0.5: R17.1 55.75,28.25 55.1,28.9 Q1.1
Q2.G
  Bottom 0.5: Q2.1 60.5,36.1 59.85,35.45 R20.2 R19.1
Q2.S
  Bottom 0.5: R21.2 67.45,36.1 C11.+ Q2.2
Q3.D
  Bottom 0.5: Q3.3 66,42.6 R30.2
Q3.G
  Bottom 0.5: Q3.1 60.9,40.65 R29.1
Q4.G
  Bottom 0.5: R30.1 64.95,45.25 64.5,44.8 63.3,44.8 C19.+ 61.65,44.9 R31.2 59.3,45.55 Q4.1
Q4.S
  Bottom 0.5: Q4.2 R32.1
RA0  (via drill 0.5)
  Top 0.5: v34.4,19.5 34.4,20.67 39.23,25.5 54,25.5 54.6,24.9 56.5,24.9 57.4,25.8 57.4,29.4 v67.5,39.5
  Bottom 0.3: U1.19 38.9,23.3 35.1,19.5 v34.4,19.5
  Bottom 0.5: v67.5,39.5 R21.1 R22.2
RA1  (via drill 0.5)
  Top 0.5: v32.7,20.1 38.9,26.3 v55,26.3
  Bottom 0.3: U1.20 38.1,23.7 35.1,20.7 33.3,20.7 v32.7,20.1
  Bottom 0.5: R16.1 R17.2 56.65,26.3 v55,26.3
RA2
  Bottom 0.3: R25.2 16.4,19.9 17.8,21.3 34.85,21.3 37.3,23.75 U1.21
RA3
  Bottom 0.3: R24.2 34.6,21.9 36.5,23.8 U1.22
SW1.1
  Bottom 0.5: SW1.1 5.02,27.97 R13.2
SW1.2
  Bottom 0.5: SW1.2 7.06,28.01 R14.2
SW1.3
  Bottom 0.5: SW1.3 9.1,31.7 8.6,32.2 4.3,32.2 3.55,31.45 R10.2
SW1.4
  Bottom 0.5: SW1.4 11.14,28.01 R15.2
SW1.A
  Bottom 0.5: R1.1 R6.1 21.25,33.35 20.8,32.9 C2.+ 15.7,32.9 9.1,39.5 SW1.B
SW1.B
  Bottom 0.5: R2.1 R7.1 21.45,26.35 21,25.9 C4.+ 17.4,25.9 16.2,27.1 16.2,31.07 6.56,40.71 SW1.A
U4.1
  Bottom 0.5: R12.1 91.2,27.75 U2.1
U4.3
  Bottom 0.3: R27.1 65.9,25 67.5,26.6 67.5,28.2 68.9,29.6 78,29.6 78.3,29.9 U4.3
VBAT  (via drill 0.5)
  Route15 0.5: C12.+ 66.1,31.85 86.25,31.85 87,31.1 v87,30.5
  Bottom 0.5: U2.3 89.83,30.45 88,28.61 F1.2 | F1.2 86.78,28.4 C10.+ C15.+ 80.95,28.45 U3.1 77.35,28.45 76.9,28 76.9,26.9 77.25,26.55 U3.3 | U4.1 79.05,32.45 80,33.4 C14.+ 82.1,33.4 82.4,33.1 82.4,32.7 83.4,31.7 85.81,31.7 86.5,31.01 86.5,31 v87,30.5 F1.2 | C12.+ 65,32 63.1,33.9 Q2.3 60.8,33.9 60.45,33.55 R20.1
VUSB  (via drill 0.5)
  Route15 0.5: v89.8,27.6 89.8,29 92.4,31.6 v93.8,31.6
  Bottom 0.3: U2.4 94.65,30.45 94.8,30.3 J1.1
  Bottom 0.5: LED2.A 90.1,27.3 v89.8,27.6 | U2.4 v93.8,31.59 v93.8,31.6

### Text on the board
_bPlace: BT1
_tNames: B1
_bNames: C19 | Q4 | R32 | R31 | R28 | Q3 | R30 | C11 | C16 | R29 | R21 | R22 | C5 | C18 | C2 | U1 | R20 | R6 | R1 | R19 | R5 | R3 | LED1 | R4 | C21 | C14 | Q2 | C12 | C1 | C3 | U4 | Q1 | U2 | C4 | C10 | F1 | SW1 | R7 | R2 | C6 | C7 | C20 | C17 | LED2 | R27 | U3 | R13 | R14 | R15 | R17 | R16 | C15 | J1 | R12 | R18 | R10 | R24 | C9 | R25 | R11 | R26 | C13 | C8 | R9 | R8